# EAGLE design untitled-RS485 (EAGLE 9.6.1)
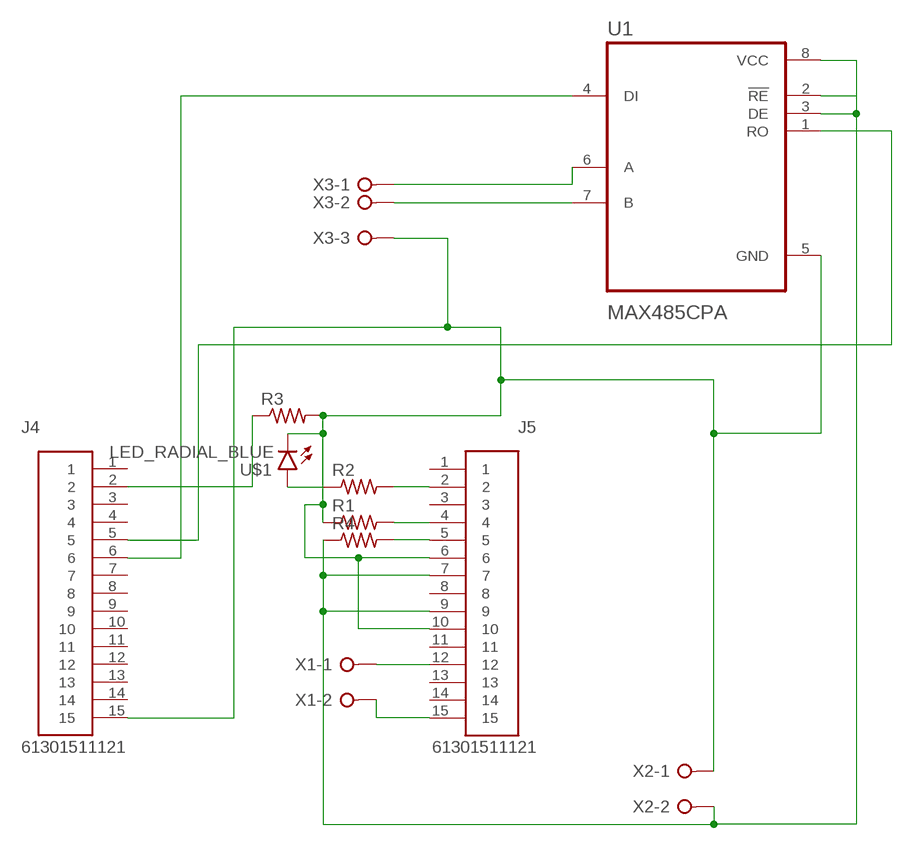
[diagram p0: schematic, sheet 1]

## Parts
J4  61301511121  [61301511121]
J5  61301511121  [61301511121]
R1  R-US_0207/7  [0207/7]
R2  R-US_0207/7  [0207/7]
R3  R-US_0207/7  [0207/7]
R4  R-US_0207/7  [0207/7]
U1  MAX485CPA  [DIP794W47P254L991H457Q8]
U$1  LED_RADIAL_BLUE  [LEDRD254W60D565H860B_B]
X1  W237-02P  [W237-132]
X2  W237-02P  [W237-132]
X3  W237-03P  [W237-133]

## Nets
N$1: J4.2 R3.1
N$2: J5.5 R4.2
N$3: J4.5 U1.1(RO)
N$4: J4.6 U1.4(DI)
N$5: J5.2 R2.2
N$6: R2.1 U$1.1(A)
N$7: U1.7(B) X3.2
N$8: J5.4 R1.2
N$9: J4.15 J5.6 J5.10 R1.1 R3.2 U1.5(GND) U$1.2(C) X2.1 X3.3
N$10: U1.6(A) X3.1
N$13: J5.7 J5.9 R4.1 U1.2(!RE) U1.3(DE) U1.8(VCC) X2.2
N$14: J5.12 X1.1
N$15: J5.15 X1.2
Unconnected: J4.1 J4.3 J4.4 J4.7 J4.8 J4.9 J4.10 J4.11 J4.12 J4.13 J4.14 J5.1 J5.3 J5.8 J5.11 J5.13 J5.14

## Library data of the parts
J4 J5 = Headers:61301511121: CONN HEADER VERT 15POS 2.54MM Manufacturer's datasheet <https://katalog.we-online.de/em/datasheet/6130xx11121.pdf>; CREATED_BY: PCBLayout.com; DIGIKEY_PART_NUMBER: 732-5326-ND; MANUFACTURER: Wurth Electronics Inc.; MPN: 61301511121
R1-R4 = BeagleBone_Black_Wireless:R-US_: RESISTOR, American symbol
U1 = MAX485CPA:MAX485CPA; AVAILABILITY: Unavailable; DESCRIPTION: 1/1 Transceiver Half RS422, RS485 8-PDIP; MF: Maxim Integrated; MP: MAX485CPA+; PACKAGE: PDIP-8 Maxim; PRICE: None
U$1 = Opto-Electronic:LED_RADIAL: LED - Generic; CATEGORY: Opto-Electronic; SUB-CATEGORY: LED
X1 X2 = con-wago-508:W237-02P: WAGO SREW CLAMP; OC_FARNELL: unknown; OC_NEWARK: unknown
X3 = con-wago-508:W237-03P: WAGO SREW CLAMP; OC_FARNELL: unknown; OC_NEWARK: unknown

## Board
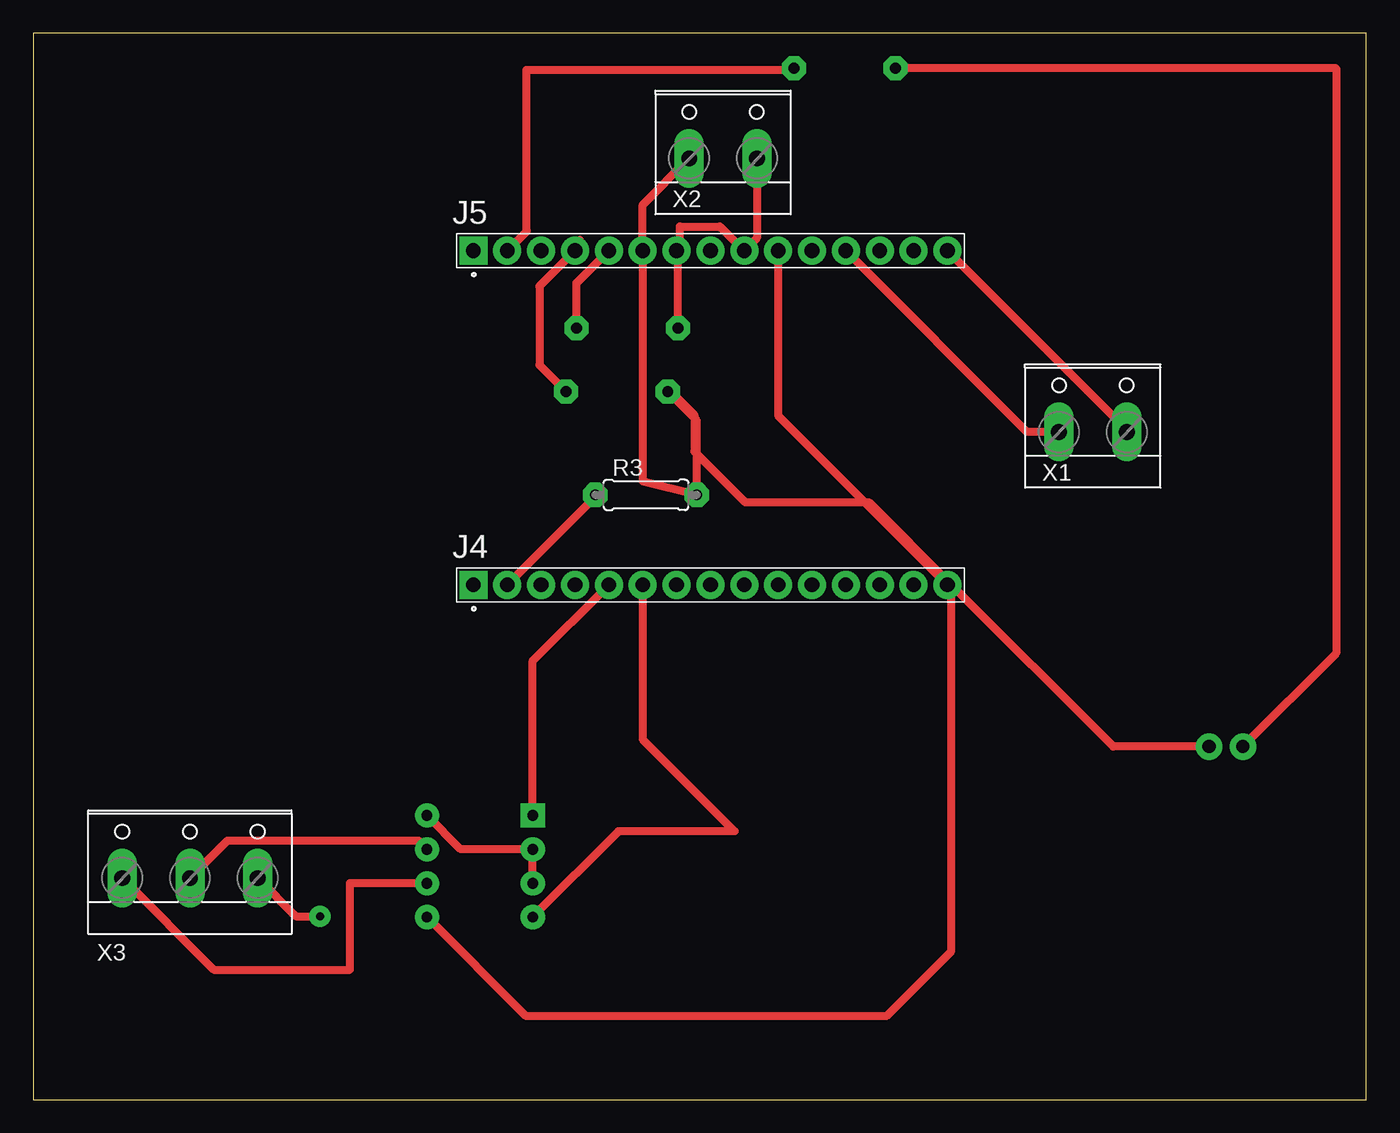
[diagram p1: board, top side]
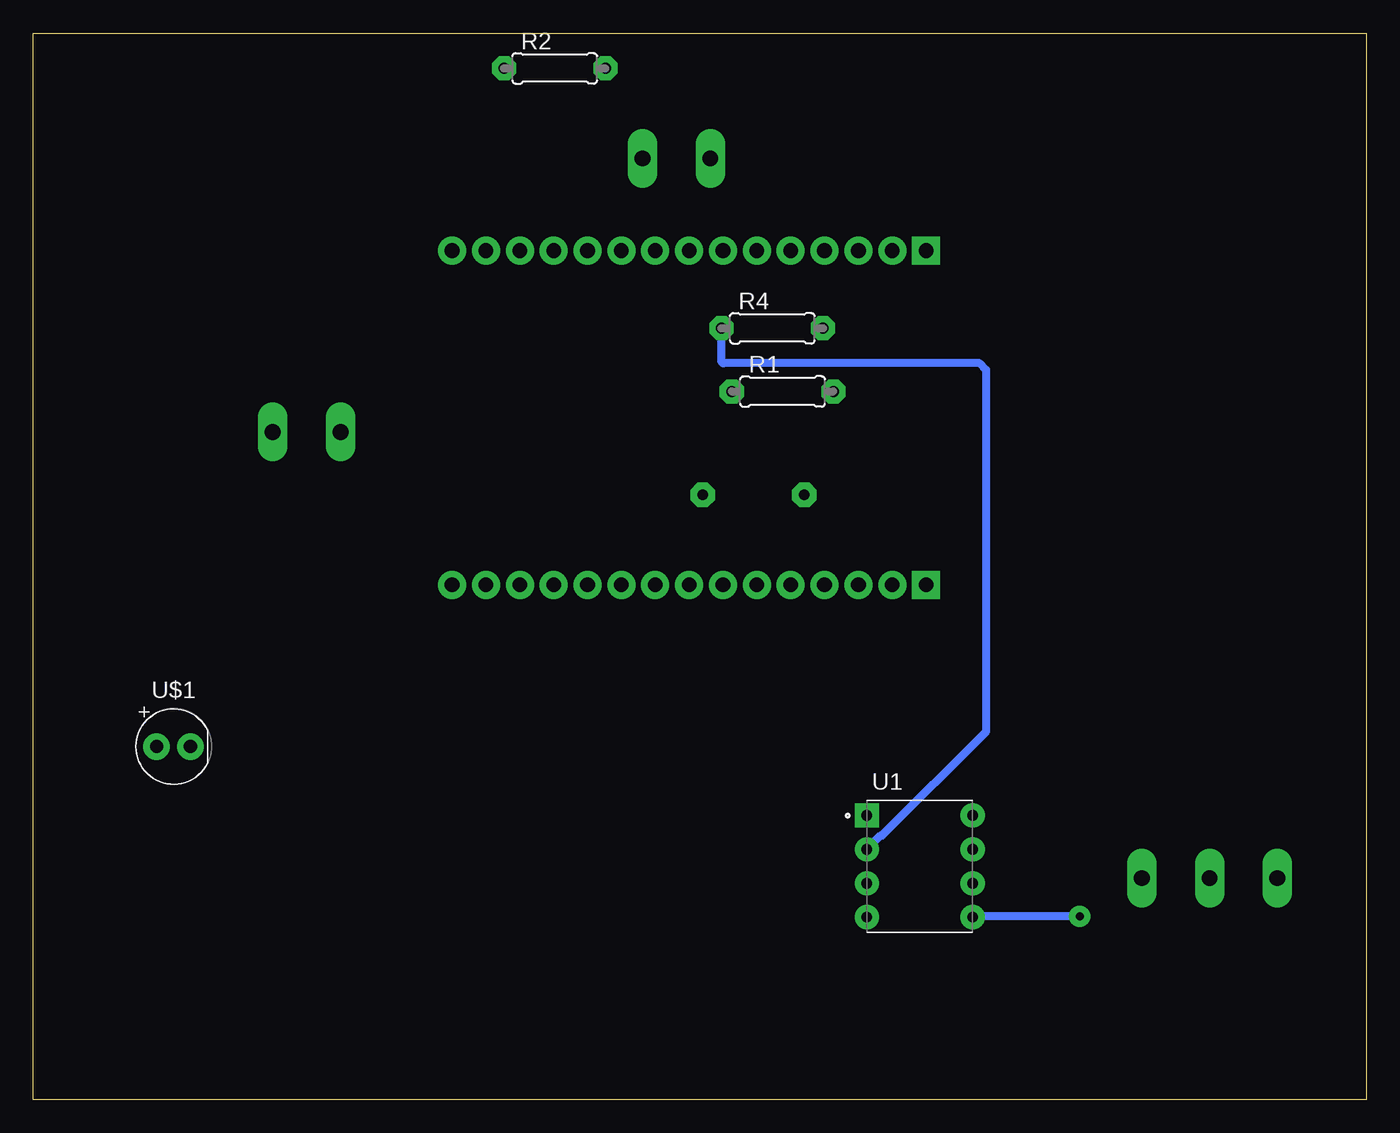
[diagram p2: board, bottom side, seen from below]

Size 100 x 80 mm. Coordinates in mm from the lower left corner, seen from the top.
Outline: 0,0 100,0 100,80 0,80 0,0
Copper layers (1*16): Top 0.035mm / dielectric 1.5mm / Bottom 0.035mm
Design rules "default *": minimum track width 0.6mm, minimum drill 0.6mm, track to track 0.4mm, track to pad 0.3mm, pad to pad 0.3mm, via to via 0.3mm, smd to smd 6mil, copper to edge 40mil, drill to drill 6mil, minimum pad ring 0.5mm, minimum via ring 0.5mm, stop-mask expansion 4mil, vias tented up to drill 0mil, thermal gap 10mil

### Footprints (pad centres in the part's own frame; a part is rotated, then mirrored left to right if it is on the bottom)
61301511121 = drill 1.1 square: 1 -17.78,0 | drill 1.1: 2 -15.24,0; 3 -12.7,0; 4 -10.16,0; 5 -7.62,0; 6 -5.08,0; 7 -2.54,0; 8 0,0; 9 2.54,0; 10 5.08,0; 11 7.62,0; 12 10.16,0; 13 12.7,0; 14 15.24,0; 15 17.78,0
0207/7 = drill 0.813 octagon: 1 -3.81,0; 2 3.81,0
DIP794W47P254L991H457Q8 = drill 0.81 pad 1.22 square: 1 -3.97,3.81 | drill 0.81 pad 1.22: 2 -3.97,1.27; 3 -3.97,-1.27; 4 -3.97,-3.81; 5 3.97,-3.81; 6 3.97,-1.27; 7 3.97,1.27; 8 3.97,3.81
LEDRD254W60D565H860B_B = drill 0.981 pad 1.581: 1 -1.27,0; 2 1.27,0
W237-132 = drill 1.194 long: 1 -2.54,-0.635; 2 2.54,-0.635
W237-133 = drill 1.194 long: 1 -5.08,-0.635; 2 0,-0.635; 3 5.08,-0.635

### Placement (x,y rotation side)
J4  50.8,38.62 0 top
J5  50.8,63.69 0 top
R1  43.79,53.12 0 bottom
R2  60.88,77.37 0 bottom
R3  45.97,45.37 0 top
R4  44.56,57.87 0 bottom
U1  33.5,17.5 0 bottom
U$1  89.48,26.48 0 bottom
X1  79.49,50.73 0 top
X2  51.75,71.25 0 top
X3  11.75,17.25 0 top

### Tracks (layer width: path | path; a pad name or v marks a point on that pad's centre or on a via)
N$1
  Top 0.61: R3.1 42.16,45.22 J4.2
N$2
  Top 0.61: R4.2 40.75,61.26 J5.5
N$3
  Top 0.6: U1.1 37.47,32.91 J4.5
N$4
  Top 0.6: 45.78,38.62 J4.6 45.72,27.02 52.62,20.12 43.9,20.12 U1.4
N$5
  Top 0.6: R2.2 56.95,77.25 37,77.25 37,65.2 37.03,65.16 J5.2
N$6
  Top 0.6: R2.1 97.75,77.37 97.75,33.48 U$1.1
N$7
  Top 0.6: U1.7 28.89,19.41 14.54,19.41 X3.2
N$8
  Top 0.6: 41,64.5 41,64 J5.4
  Top 0.61: R1.2 37.98,55.12 37.98,61.03 J5.4
N$9  (via drill 0.6)
  Top 0.6: R3.2 45.72,46.38 J5.6 45.72,67.12 X2.1 | R1.1 47.85,53.12 49.6,51.37 49.6,48.62 53.4,44.82 62.68,44.82 68.88,38.62 | J4.15 55.88,51.32 J5.10 | U$1.2 81.02,26.48 68.88,38.62 | 68.88,38.62 68.88,11.13 64,6.25 36.97,6.25 U1.5 | X3.3 19.7,13.75 v21.5,13.75
  Top 0.61: R3.2 49.78,50.94 R1.1 | 68.88,38.62 J4.15
  Bottom 0.6: v21.5,13.75 29.47,13.75 U1.5
N$10
  Top 0.6: X3.1 13.54,9.75 23.75,9.75 23.75,16.25 29.51,16.25 U1.6
N$13
  Top 0.6: J5.7 48.5,64 48.5,65.5 51.5,65.5 53,64 J5.9 54.29,64.64 X2.2 | U1.8 32.07,18.77 U1.2 U1.3
  Top 0.61: R4.1 48.37,63.58 J5.7
  Bottom 0.6: U1.2 36.44,19.8 36.32,19.8 28.5,27.62 28.5,54.75 29,55.25 48.25,55.25 48.37,55.37 R4.1
N$14
  Top 0.6: X1.1 74.56,50.09 J5.12
N$15
  Top 0.6: J5.15 82.03,50.24 X1.2